# EAGLE schematic Totem (EAGLE 8.6.1)
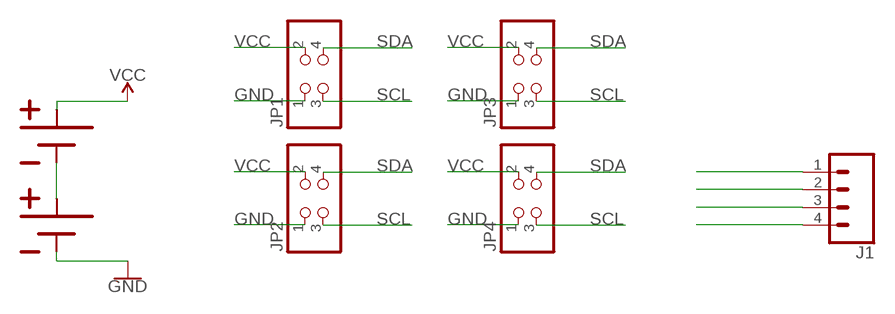
[diagram p0: schematic, sheet 1]

## Parts
J1  CONN_04  [1X04]
JP1  PINHD-2X2  [2X02]
JP2  PINHD-2X2  [2X02]
JP3  PINHD-2X2  [2X02]
JP4  PINHD-2X2  [2X02]
U$1  EAGLEAABATTERY  [ONEAAHOLDER]
U$2  EAGLEAABATTERY  [ONEAAHOLDER]

## Nets
GND: J1.4 JP1.1 JP2.1 JP3.1 JP4.1 U$2.NEG
N$1: U$1.NEG U$2.POS
SCL: J1.3 JP1.3 JP2.3 JP3.3 JP4.3
SDA: J1.2 JP1.4 JP2.4 JP3.4 JP4.4
VCC: J1.1 JP1.2 JP2.2 JP3.2 JP4.2 U$1.POS

## Library data of the parts
J1 = SparkFun-Connectors:CONN_04: Multi connection point. Often used as Generic Header-pin footprint for 0.1 inch spaced/style header connections On any of the 0.1 inch spaced packages, you can populate with these: Break Away Headers - Straight <https://www.sparkfun.com/products/116> (PRT-00116) Break Away Male Headers - Right Angle <https://www.sparkfun.com/products/553> (PRT-00553) Female Headers <https://www.sparkfun.com/products/115> (PRT-00115) Break Away Headers - Machine Pin <https://www.sparkfun.com/products/117> (PRT-00117) Break Away Female Headers - Swiss Machine Pin <https://www.sparkfun.com/products/743> (PRT-00743) For SCREWTERMINALS and SPRING TERMINALS visit here: Screw Terimnals on SparkFun.com <https://www.sparkfun.com/search/results?term=Screw+Terminals> (5mm/3.5mm/2.54mm spacing) This device is also useful as a general connection point to wire up your design to another part of your project. Our various solder wires solder well into these plated through hole pads. Hook-Up Wire - Assortment (Stranded, 22 AWG) <https://www.sparkfun.com/products/11375> (PRT-11375) Hook-Up Wire - Assortment (Solid Core, 22 AWG) <https://www.sparkfun.com/products/11367> (PRT-11367) View the entire wire category on our website here <https://www.sparkfun.com/categories/141> Special notes: Molex polarized connector foot print use with SKU : PRT-08231 with associated crimp pins and housings. 1MM SMD Version SKU: PRT-10208; PROD_ID: CONN-09696
JP1-JP4 = pinhead:PINHD-2X2: PIN HEADER
U$1 U$2 = AddonTotem:EAGLEAABATTERY: Eagle Plastic Devices 12BH311P-GR